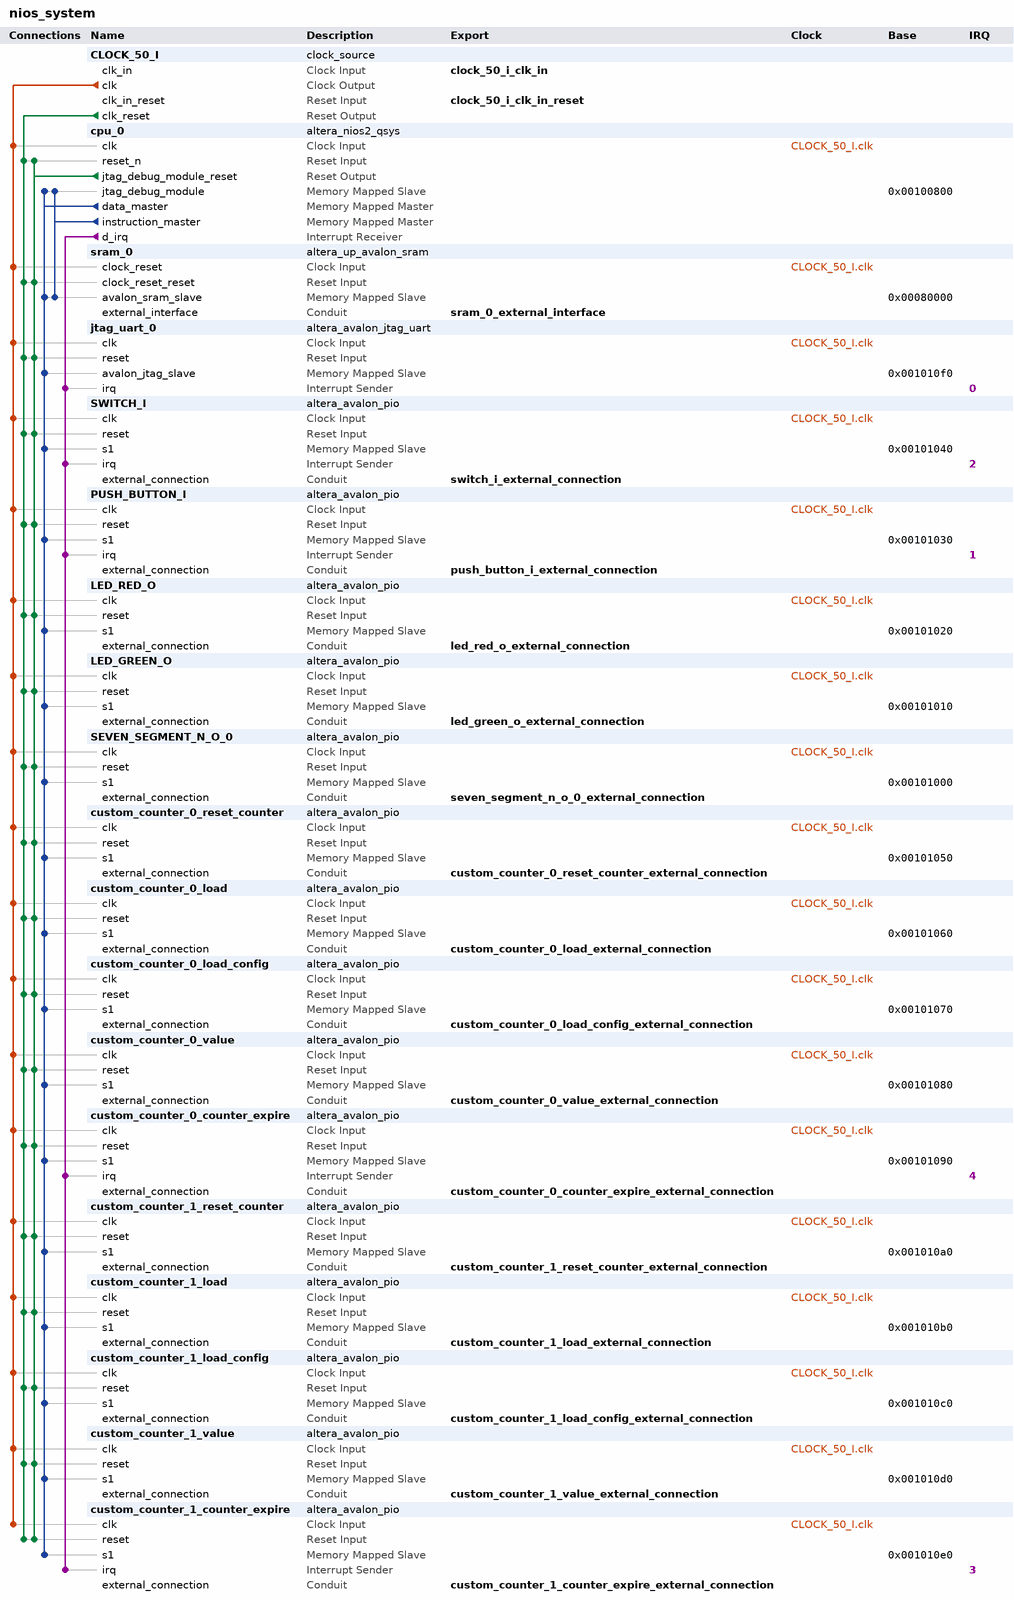
[diagram p0: system contents]
# Platform Designer (Qsys) system nios_system, Cyclone II EP2C35F672C6
# Parameters at their usual value, and those the tool derives, are not listed.
package require -exact qsys 12.0
create_system nios_system
set_project_property DEVICE_FAMILY {Cyclone II}
set_project_property DEVICE EP2C35F672C6

add_instance CLOCK_50_I clock_source 12.0
set_instance_parameter_value CLOCK_50_I clockFrequency 50000000

add_instance cpu_0 altera_nios2_qsys 12.0
set_instance_parameter_value cpu_0 resetSlave sram_0.avalon_sram_slave
set_instance_parameter_value cpu_0 exceptionSlave sram_0.avalon_sram_slave
set_instance_parameter_value cpu_0 breakSlave cpu_0.jtag_debug_module
set_instance_parameter_value cpu_0 impl Tiny
set_instance_parameter_value cpu_0 icache_size 4096

add_instance sram_0 altera_up_avalon_sram 11.0
set_instance_parameter_value sram_0 board DE2
set_instance_parameter_value sram_0 pixel_buffer false

add_instance jtag_uart_0 altera_avalon_jtag_uart 12.0
set_instance_parameter_value jtag_uart_0 simInteractiveOptions INTERACTIVE_ASCII_OUTPUT

add_instance SWITCH_I altera_avalon_pio 12.0
set_instance_parameter_value SWITCH_I captureEdge true
set_instance_parameter_value SWITCH_I direction Input
set_instance_parameter_value SWITCH_I edgeType ANY
set_instance_parameter_value SWITCH_I generateIRQ true
set_instance_parameter_value SWITCH_I irqType EDGE
set_instance_parameter_value SWITCH_I width 17

add_instance PUSH_BUTTON_I altera_avalon_pio 12.0
set_instance_parameter_value PUSH_BUTTON_I captureEdge true
set_instance_parameter_value PUSH_BUTTON_I direction Input
set_instance_parameter_value PUSH_BUTTON_I edgeType ANY
set_instance_parameter_value PUSH_BUTTON_I generateIRQ true
set_instance_parameter_value PUSH_BUTTON_I irqType EDGE
set_instance_parameter_value PUSH_BUTTON_I width 4

add_instance LED_RED_O altera_avalon_pio 12.0
set_instance_parameter_value LED_RED_O direction Output
set_instance_parameter_value LED_RED_O width 18

add_instance LED_GREEN_O altera_avalon_pio 12.0
set_instance_parameter_value LED_GREEN_O direction Output
set_instance_parameter_value LED_GREEN_O width 9

add_instance SEVEN_SEGMENT_N_O_0 altera_avalon_pio 12.0
set_instance_parameter_value SEVEN_SEGMENT_N_O_0 direction Output
set_instance_parameter_value SEVEN_SEGMENT_N_O_0 width 7

add_instance custom_counter_0_reset_counter altera_avalon_pio 12.0
set_instance_parameter_value custom_counter_0_reset_counter direction Output
set_instance_parameter_value custom_counter_0_reset_counter width 1

add_instance custom_counter_0_load altera_avalon_pio 12.0
set_instance_parameter_value custom_counter_0_load direction Output
set_instance_parameter_value custom_counter_0_load width 1

add_instance custom_counter_0_load_config altera_avalon_pio 12.0
set_instance_parameter_value custom_counter_0_load_config direction Output
set_instance_parameter_value custom_counter_0_load_config width 2

add_instance custom_counter_0_value altera_avalon_pio 12.0
set_instance_parameter_value custom_counter_0_value direction Input
set_instance_parameter_value custom_counter_0_value width 27

add_instance custom_counter_0_counter_expire altera_avalon_pio 12.0
set_instance_parameter_value custom_counter_0_counter_expire captureEdge true
set_instance_parameter_value custom_counter_0_counter_expire direction Input
set_instance_parameter_value custom_counter_0_counter_expire generateIRQ true
set_instance_parameter_value custom_counter_0_counter_expire irqType EDGE
set_instance_parameter_value custom_counter_0_counter_expire width 1

add_instance custom_counter_1_reset_counter altera_avalon_pio 12.0
set_instance_parameter_value custom_counter_1_reset_counter direction Output
set_instance_parameter_value custom_counter_1_reset_counter width 1

add_instance custom_counter_1_load altera_avalon_pio 12.0
set_instance_parameter_value custom_counter_1_load direction Output
set_instance_parameter_value custom_counter_1_load width 1

add_instance custom_counter_1_load_config altera_avalon_pio 12.0
set_instance_parameter_value custom_counter_1_load_config direction Output
set_instance_parameter_value custom_counter_1_load_config width 2

add_instance custom_counter_1_value altera_avalon_pio 12.0
set_instance_parameter_value custom_counter_1_value direction Input
set_instance_parameter_value custom_counter_1_value width 27

add_instance custom_counter_1_counter_expire altera_avalon_pio 12.0
set_instance_parameter_value custom_counter_1_counter_expire captureEdge true
set_instance_parameter_value custom_counter_1_counter_expire direction Input
set_instance_parameter_value custom_counter_1_counter_expire generateIRQ true
set_instance_parameter_value custom_counter_1_counter_expire irqType EDGE
set_instance_parameter_value custom_counter_1_counter_expire width 1

# connections
add_connection CLOCK_50_I.clk cpu_0.clk clock
add_connection CLOCK_50_I.clk custom_counter_0_counter_expire.clk clock
add_connection CLOCK_50_I.clk custom_counter_0_load.clk clock
add_connection CLOCK_50_I.clk custom_counter_0_load_config.clk clock
add_connection CLOCK_50_I.clk custom_counter_0_reset_counter.clk clock
add_connection CLOCK_50_I.clk custom_counter_0_value.clk clock
add_connection CLOCK_50_I.clk custom_counter_1_counter_expire.clk clock
add_connection CLOCK_50_I.clk custom_counter_1_load.clk clock
add_connection CLOCK_50_I.clk custom_counter_1_load_config.clk clock
add_connection CLOCK_50_I.clk custom_counter_1_reset_counter.clk clock
add_connection CLOCK_50_I.clk custom_counter_1_value.clk clock
add_connection CLOCK_50_I.clk jtag_uart_0.clk clock
add_connection CLOCK_50_I.clk LED_GREEN_O.clk clock
add_connection CLOCK_50_I.clk LED_RED_O.clk clock
add_connection CLOCK_50_I.clk PUSH_BUTTON_I.clk clock
add_connection CLOCK_50_I.clk SEVEN_SEGMENT_N_O_0.clk clock
add_connection CLOCK_50_I.clk sram_0.clock_reset clock
add_connection CLOCK_50_I.clk SWITCH_I.clk clock
add_connection CLOCK_50_I.clk_reset cpu_0.reset_n reset
add_connection CLOCK_50_I.clk_reset custom_counter_0_counter_expire.reset reset
add_connection CLOCK_50_I.clk_reset custom_counter_0_load.reset reset
add_connection CLOCK_50_I.clk_reset custom_counter_0_load_config.reset reset
add_connection CLOCK_50_I.clk_reset custom_counter_0_reset_counter.reset reset
add_connection CLOCK_50_I.clk_reset custom_counter_0_value.reset reset
add_connection CLOCK_50_I.clk_reset custom_counter_1_counter_expire.reset reset
add_connection CLOCK_50_I.clk_reset custom_counter_1_load.reset reset
add_connection CLOCK_50_I.clk_reset custom_counter_1_load_config.reset reset
add_connection CLOCK_50_I.clk_reset custom_counter_1_reset_counter.reset reset
add_connection CLOCK_50_I.clk_reset custom_counter_1_value.reset reset
add_connection CLOCK_50_I.clk_reset jtag_uart_0.reset reset
add_connection CLOCK_50_I.clk_reset LED_GREEN_O.reset reset
add_connection CLOCK_50_I.clk_reset LED_RED_O.reset reset
add_connection CLOCK_50_I.clk_reset PUSH_BUTTON_I.reset reset
add_connection CLOCK_50_I.clk_reset SEVEN_SEGMENT_N_O_0.reset reset
add_connection CLOCK_50_I.clk_reset sram_0.clock_reset_reset reset
add_connection CLOCK_50_I.clk_reset SWITCH_I.reset reset
add_connection cpu_0.jtag_debug_module_reset cpu_0.reset_n reset
add_connection cpu_0.jtag_debug_module_reset custom_counter_0_counter_expire.reset reset
add_connection cpu_0.jtag_debug_module_reset custom_counter_0_load.reset reset
add_connection cpu_0.jtag_debug_module_reset custom_counter_0_load_config.reset reset
add_connection cpu_0.jtag_debug_module_reset custom_counter_0_reset_counter.reset reset
add_connection cpu_0.jtag_debug_module_reset custom_counter_0_value.reset reset
add_connection cpu_0.jtag_debug_module_reset custom_counter_1_counter_expire.reset reset
add_connection cpu_0.jtag_debug_module_reset custom_counter_1_load.reset reset
add_connection cpu_0.jtag_debug_module_reset custom_counter_1_load_config.reset reset
add_connection cpu_0.jtag_debug_module_reset custom_counter_1_reset_counter.reset reset
add_connection cpu_0.jtag_debug_module_reset custom_counter_1_value.reset reset
add_connection cpu_0.jtag_debug_module_reset jtag_uart_0.reset reset
add_connection cpu_0.jtag_debug_module_reset LED_GREEN_O.reset reset
add_connection cpu_0.jtag_debug_module_reset LED_RED_O.reset reset
add_connection cpu_0.jtag_debug_module_reset PUSH_BUTTON_I.reset reset
add_connection cpu_0.jtag_debug_module_reset SEVEN_SEGMENT_N_O_0.reset reset
add_connection cpu_0.jtag_debug_module_reset sram_0.clock_reset_reset reset
add_connection cpu_0.jtag_debug_module_reset SWITCH_I.reset reset
add_connection cpu_0.data_master cpu_0.jtag_debug_module avalon
set_connection_parameter_value cpu_0.data_master/cpu_0.jtag_debug_module baseAddress 0x00100800
add_connection cpu_0.data_master custom_counter_0_counter_expire.s1 avalon
set_connection_parameter_value cpu_0.data_master/custom_counter_0_counter_expire.s1 baseAddress 0x00101090
add_connection cpu_0.data_master custom_counter_0_load.s1 avalon
set_connection_parameter_value cpu_0.data_master/custom_counter_0_load.s1 baseAddress 0x00101060
add_connection cpu_0.data_master custom_counter_0_load_config.s1 avalon
set_connection_parameter_value cpu_0.data_master/custom_counter_0_load_config.s1 baseAddress 0x00101070
add_connection cpu_0.data_master custom_counter_0_reset_counter.s1 avalon
set_connection_parameter_value cpu_0.data_master/custom_counter_0_reset_counter.s1 baseAddress 0x00101050
add_connection cpu_0.data_master custom_counter_0_value.s1 avalon
set_connection_parameter_value cpu_0.data_master/custom_counter_0_value.s1 baseAddress 0x00101080
add_connection cpu_0.data_master custom_counter_1_counter_expire.s1 avalon
set_connection_parameter_value cpu_0.data_master/custom_counter_1_counter_expire.s1 baseAddress 0x001010e0
add_connection cpu_0.data_master custom_counter_1_load.s1 avalon
set_connection_parameter_value cpu_0.data_master/custom_counter_1_load.s1 baseAddress 0x001010b0
add_connection cpu_0.data_master custom_counter_1_load_config.s1 avalon
set_connection_parameter_value cpu_0.data_master/custom_counter_1_load_config.s1 baseAddress 0x001010c0
add_connection cpu_0.data_master custom_counter_1_reset_counter.s1 avalon
set_connection_parameter_value cpu_0.data_master/custom_counter_1_reset_counter.s1 baseAddress 0x001010a0
add_connection cpu_0.data_master custom_counter_1_value.s1 avalon
set_connection_parameter_value cpu_0.data_master/custom_counter_1_value.s1 baseAddress 0x001010d0
add_connection cpu_0.data_master jtag_uart_0.avalon_jtag_slave avalon
set_connection_parameter_value cpu_0.data_master/jtag_uart_0.avalon_jtag_slave baseAddress 0x001010f0
add_connection cpu_0.data_master LED_GREEN_O.s1 avalon
set_connection_parameter_value cpu_0.data_master/LED_GREEN_O.s1 baseAddress 0x00101010
add_connection cpu_0.data_master LED_RED_O.s1 avalon
set_connection_parameter_value cpu_0.data_master/LED_RED_O.s1 baseAddress 0x00101020
add_connection cpu_0.data_master PUSH_BUTTON_I.s1 avalon
set_connection_parameter_value cpu_0.data_master/PUSH_BUTTON_I.s1 baseAddress 0x00101030
add_connection cpu_0.data_master SEVEN_SEGMENT_N_O_0.s1 avalon
set_connection_parameter_value cpu_0.data_master/SEVEN_SEGMENT_N_O_0.s1 baseAddress 0x00101000
add_connection cpu_0.data_master sram_0.avalon_sram_slave avalon
set_connection_parameter_value cpu_0.data_master/sram_0.avalon_sram_slave baseAddress 0x00080000
add_connection cpu_0.data_master SWITCH_I.s1 avalon
set_connection_parameter_value cpu_0.data_master/SWITCH_I.s1 baseAddress 0x00101040
add_connection cpu_0.instruction_master cpu_0.jtag_debug_module avalon
set_connection_parameter_value cpu_0.instruction_master/cpu_0.jtag_debug_module baseAddress 0x00100800
add_connection cpu_0.instruction_master sram_0.avalon_sram_slave avalon
set_connection_parameter_value cpu_0.instruction_master/sram_0.avalon_sram_slave baseAddress 0x00080000
add_connection cpu_0.d_irq custom_counter_0_counter_expire.irq interrupt
set_connection_parameter_value cpu_0.d_irq/custom_counter_0_counter_expire.irq irqNumber 4
add_connection cpu_0.d_irq custom_counter_1_counter_expire.irq interrupt
set_connection_parameter_value cpu_0.d_irq/custom_counter_1_counter_expire.irq irqNumber 3
add_connection cpu_0.d_irq jtag_uart_0.irq interrupt
set_connection_parameter_value cpu_0.d_irq/jtag_uart_0.irq irqNumber 0
add_connection cpu_0.d_irq PUSH_BUTTON_I.irq interrupt
set_connection_parameter_value cpu_0.d_irq/PUSH_BUTTON_I.irq irqNumber 1
add_connection cpu_0.d_irq SWITCH_I.irq interrupt
set_connection_parameter_value cpu_0.d_irq/SWITCH_I.irq irqNumber 2

# exported interfaces
add_interface clock_50_i_clk_in clock sink
set_interface_property clock_50_i_clk_in EXPORT_OF CLOCK_50_I.clk_in
add_interface clock_50_i_clk_in_reset reset sink
set_interface_property clock_50_i_clk_in_reset EXPORT_OF CLOCK_50_I.clk_in_reset
add_interface sram_0_external_interface conduit end
set_interface_property sram_0_external_interface EXPORT_OF sram_0.external_interface
add_interface switch_i_external_connection conduit end
set_interface_property switch_i_external_connection EXPORT_OF SWITCH_I.external_connection
add_interface push_button_i_external_connection conduit end
set_interface_property push_button_i_external_connection EXPORT_OF PUSH_BUTTON_I.external_connection
add_interface led_red_o_external_connection conduit end
set_interface_property led_red_o_external_connection EXPORT_OF LED_RED_O.external_connection
add_interface led_green_o_external_connection conduit end
set_interface_property led_green_o_external_connection EXPORT_OF LED_GREEN_O.external_connection
add_interface seven_segment_n_o_0_external_connection conduit end
set_interface_property seven_segment_n_o_0_external_connection EXPORT_OF SEVEN_SEGMENT_N_O_0.external_connection
add_interface custom_counter_1_counter_expire_external_connection conduit end
set_interface_property custom_counter_1_counter_expire_external_connection EXPORT_OF custom_counter_1_counter_expire.external_connection
add_interface custom_counter_1_value_external_connection conduit end
set_interface_property custom_counter_1_value_external_connection EXPORT_OF custom_counter_1_value.external_connection
add_interface custom_counter_1_load_config_external_connection conduit end
set_interface_property custom_counter_1_load_config_external_connection EXPORT_OF custom_counter_1_load_config.external_connection
add_interface custom_counter_1_load_external_connection conduit end
set_interface_property custom_counter_1_load_external_connection EXPORT_OF custom_counter_1_load.external_connection
add_interface custom_counter_1_reset_counter_external_connection conduit end
set_interface_property custom_counter_1_reset_counter_external_connection EXPORT_OF custom_counter_1_reset_counter.external_connection
add_interface custom_counter_0_counter_expire_external_connection conduit end
set_interface_property custom_counter_0_counter_expire_external_connection EXPORT_OF custom_counter_0_counter_expire.external_connection
add_interface custom_counter_0_value_external_connection conduit end
set_interface_property custom_counter_0_value_external_connection EXPORT_OF custom_counter_0_value.external_connection
add_interface custom_counter_0_load_config_external_connection conduit end
set_interface_property custom_counter_0_load_config_external_connection EXPORT_OF custom_counter_0_load_config.external_connection
add_interface custom_counter_0_load_external_connection conduit end
set_interface_property custom_counter_0_load_external_connection EXPORT_OF custom_counter_0_load.external_connection
add_interface custom_counter_0_reset_counter_external_connection conduit end
set_interface_property custom_counter_0_reset_counter_external_connection EXPORT_OF custom_counter_0_reset_counter.external_connection

save_system nios_system.qsys
